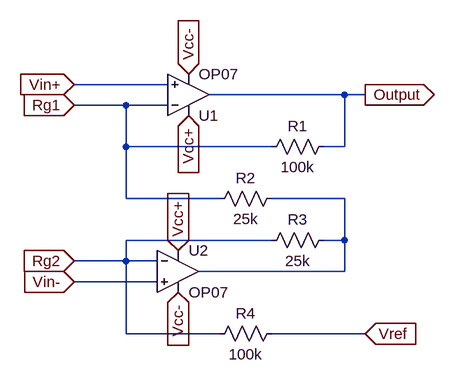
[diagram p0: schematic ina122.asc]
ina122.asc, the LTspice schematic file:
Version 4
SHEET 1 880 680
WIRE 160 112 16 112
WIRE 432 128 224 128
WIRE 464 128 432 128
WIRE 96 144 16 144
WIRE 160 144 96 144
WIRE 96 208 96 144
WIRE 320 208 96 208
WIRE 432 208 432 128
WIRE 432 208 400 208
WIRE 96 288 96 208
WIRE 240 288 96 288
WIRE 432 288 320 288
WIRE 320 352 96 352
WIRE 432 352 432 288
WIRE 432 352 400 352
WIRE 96 384 96 352
WIRE 96 384 16 384
WIRE 144 384 96 384
WIRE 432 400 432 352
WIRE 432 400 208 400
WIRE 144 416 16 416
WIRE 96 496 96 384
WIRE 240 496 96 496
WIRE 464 496 320 496
FLAG 464 128 Output
IOPIN 464 128 Out
FLAG 464 496 Vref
IOPIN 464 496 In
FLAG 16 144 Rg1
IOPIN 16 144 In
FLAG 16 384 Rg2
IOPIN 16 384 In
FLAG 16 112 Vin+
IOPIN 16 112 In
FLAG 16 416 Vin-
IOPIN 16 416 In
FLAG 192 160 Vcc+
IOPIN 192 160 In
FLAG 176 368 Vcc+
IOPIN 176 368 In
FLAG 192 96 Vcc-
IOPIN 192 96 In
FLAG 176 432 Vcc-
IOPIN 176 432 In
SYMBOL OpAmps\\OP07 192 192 M180
SYMATTR InstName U1
SYMBOL OpAmps\\OP07 176 336 R0
SYMATTR InstName U2
SYMBOL res 416 192 R90
WINDOW 0 0 56 VBottom 2
WINDOW 3 32 56 VTop 2
SYMATTR InstName R1
SYMATTR Value 100k
SYMBOL res 336 272 R90
WINDOW 0 0 56 VBottom 2
WINDOW 3 32 56 VTop 2
SYMATTR InstName R2
SYMATTR Value 25k
SYMBOL res 416 336 R90
WINDOW 0 0 56 VBottom 2
WINDOW 3 32 56 VTop 2
SYMATTR InstName R3
SYMATTR Value 25k
SYMBOL res 336 480 R90
WINDOW 0 0 56 VBottom 2
WINDOW 3 32 56 VTop 2
SYMATTR InstName R4
SYMATTR Value 100k

The netlist it stands for:
* ina122.asc
XU1 Vin+ Rg1 Vcc+ Vcc- Output LT1001  ; OP07, pins In+ In- V+ V- OUT
XU2 Vin- Rg2 Vcc+ Vcc- N001 LT1001  ; OP07, pins In+ In- V+ V- OUT
R1 Output Rg1 100k
R2 N001 Rg1 25k
R3 N001 Rg2 25k
R4 Vref Rg2 100k
.lib LTC.lib
.backanno
.end